# Altium schematic sheet WIFI_BT.SchDoc
size A3
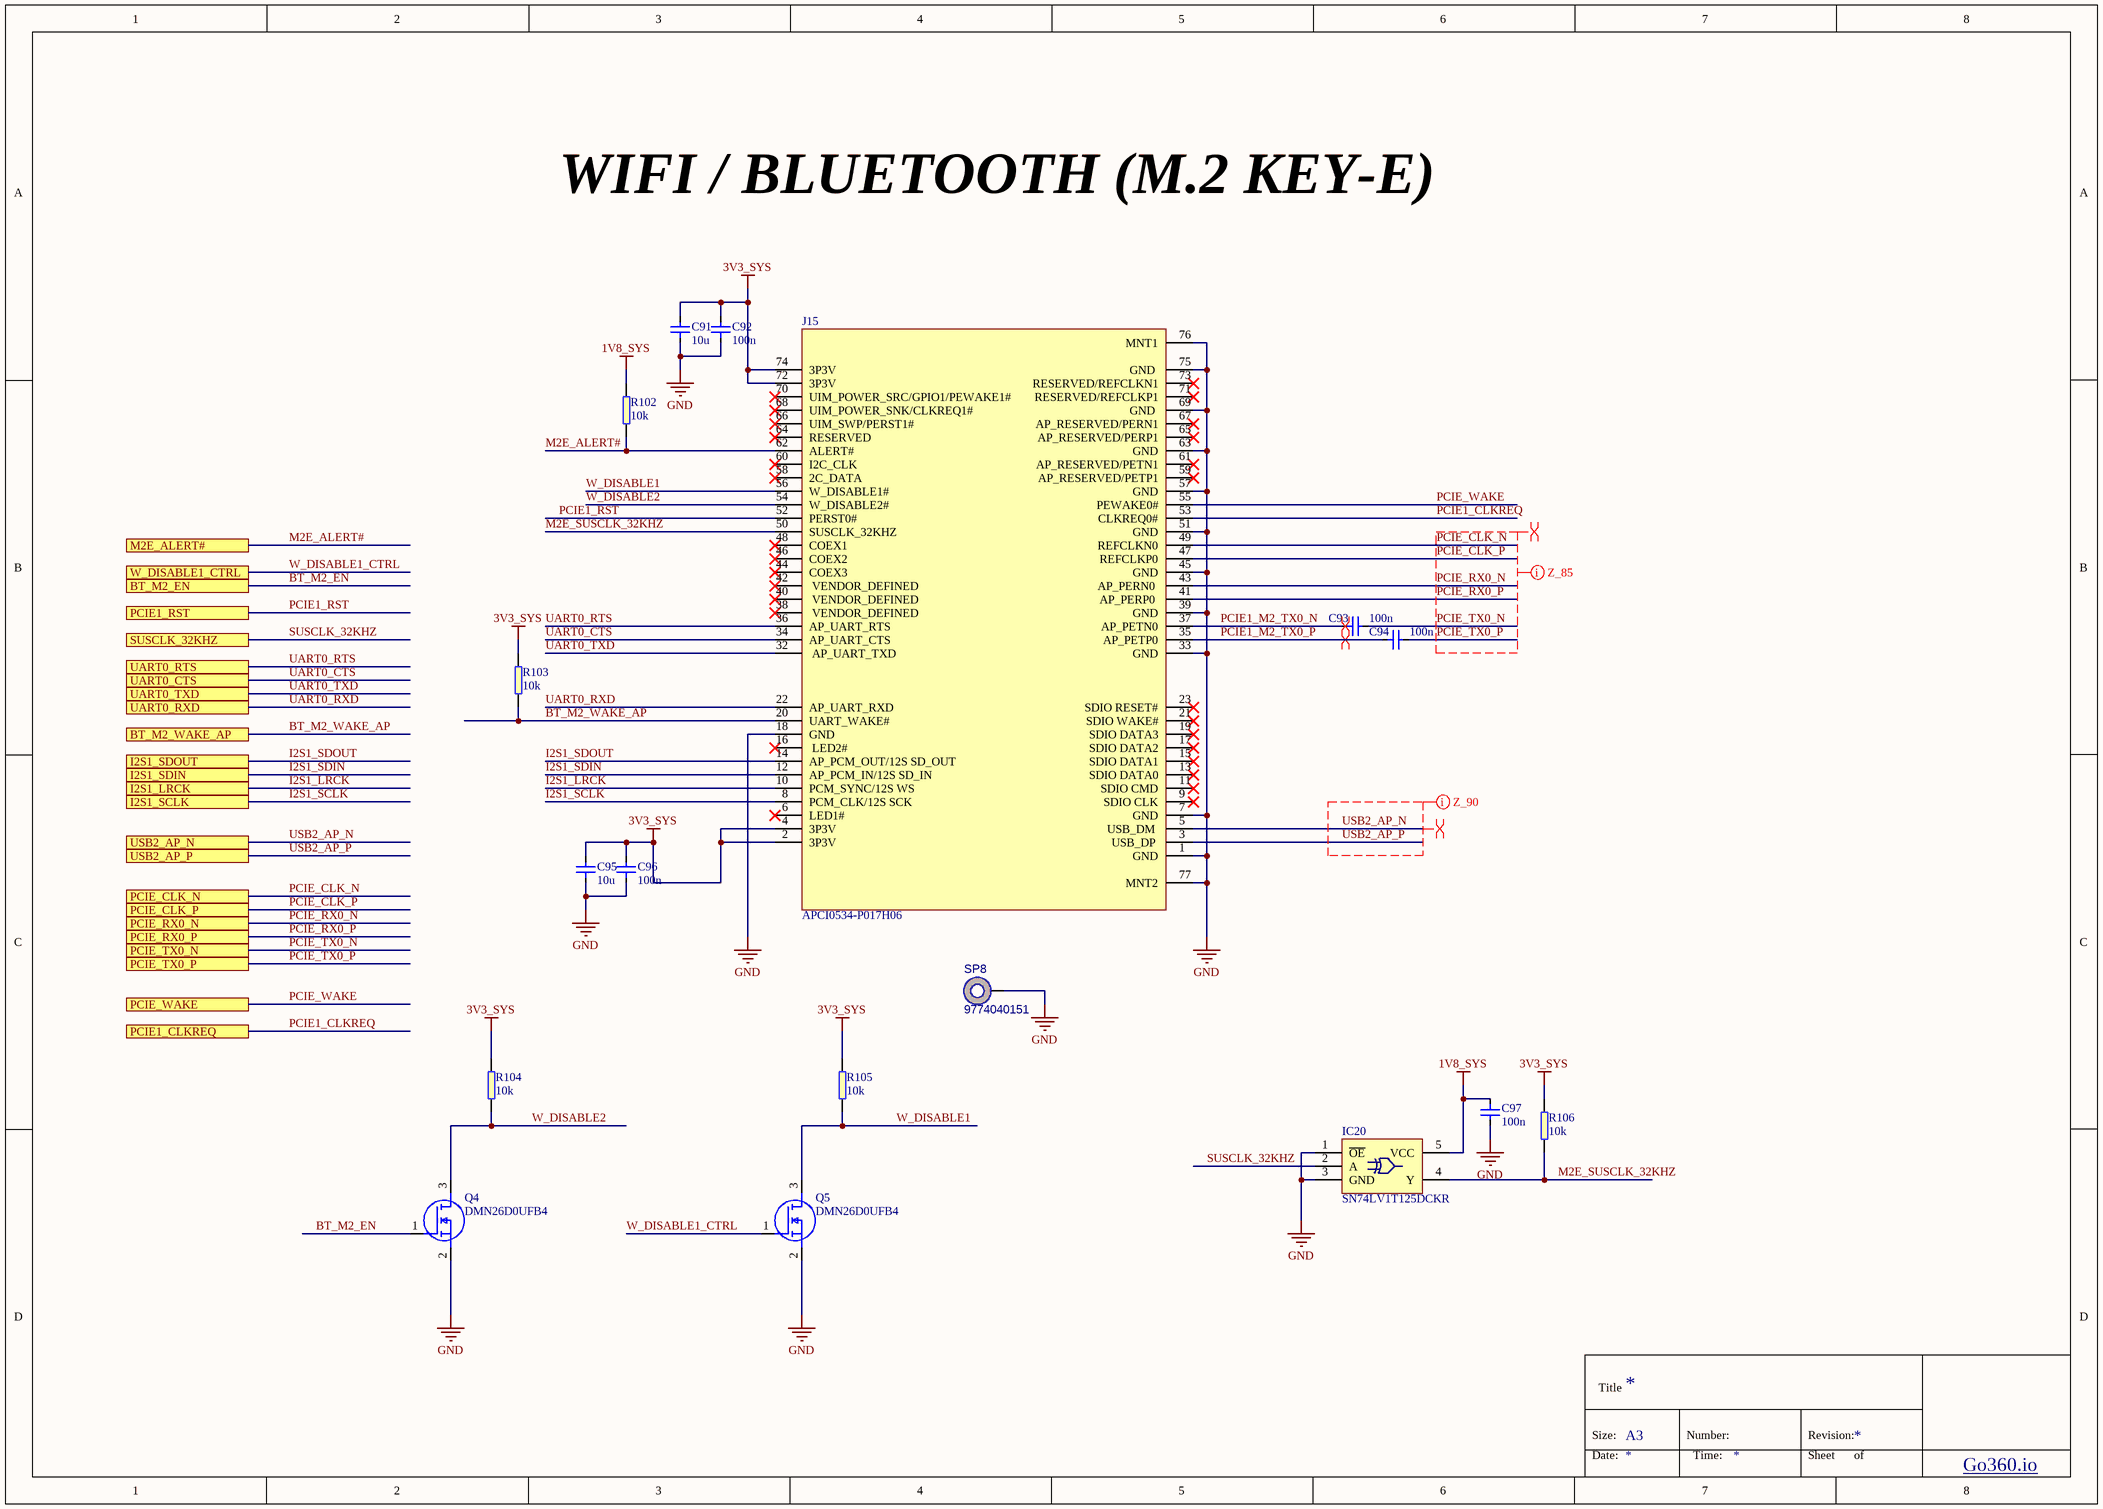
[diagram p0: WIFI_BT.SchDoc]

## Parts
C91  10u  [C0603]
C92  100n  [C0402]
C93  100n  [C0402]
C94  100n  [C0402]
C95  10u  [C0603]
C96  100n  [C0402]
C97  100n  [C0402]
IC20  SN74LV1T125DCKR  [SC70-5]
J15  APCI0534-P017H06  [CON_MINIPEX_067_SMT_RA_M2_KEYE_C]
Q4  DMN26D0UFB4  [DMN26D0UFB47]
Q5  DMN26D0UFB4  [DMN26D0UFB47]
R102  10k  [R0402]
R103  10k  [R0402]
R104  10k  [R0402]
R105  10k  [R0402]
R106  10k  [R0402]
SP8  9774040151  [MEC_STANDOFF_PTH_620C380P]

## Ports
BT_M2_EN, BT_M2_WAKE_AP, I2S1_LRCK, I2S1_SCLK, I2S1_SDIN, I2S1_SDOUT, M2E_ALERT#, PCIE1_CLKREQ, PCIE1_RST, PCIE_CLK_N, PCIE_CLK_P, PCIE_RX0_N, PCIE_RX0_P, PCIE_TX0_N, PCIE_TX0_P, PCIE_WAKE, SUSCLK_32KHZ, UART0_CTS, UART0_RTS, UART0_RXD, UART0_TXD, USB2_AP_N, USB2_AP_P, W_DISABLE1_CTRL

## Nets
1V8_SYS: C97.1 IC20.5(VCC) R102.2
3V3_SYS: C91.2 C92.2 C95.2 C96.2 J15.2(3P3V) J15.4(3P3V) J15.72(3P3V) J15.74(3P3V) R103.2 R104.2 R105.2 R106.2
GND: C91.1 C92.1 C95.1 C96.1 C97.2 IC20.1(~{OE}) IC20.3(GND) J15.1(GND) J15.7(GND) J15.18(GND) J15.33(GND) J15.39(GND) J15.45(GND) J15.51(GND) J15.57(GND) J15.63(GND) J15.69(GND) J15.75(GND) J15.76(MNT1) J15.77(MNT2) Q4.2(S) Q5.2(S) SP8.1
BT_M2_EN: Q4.1(G) ; port BT_M2_EN
BT_M2_WAKE_AP: J15.20(UART_WAKE#) R103.1 ; port BT_M2_WAKE_AP
I2S1_LRCK: J15.10(PCM_SYNC/12S_WS) ; port I2S1_LRCK
I2S1_SCLK: J15.8(PCM_CLK/12S_SCK) ; port I2S1_SCLK
I2S1_SDIN: J15.12(AP_PCM_IN/12S_SD_IN) ; port I2S1_SDIN
I2S1_SDOUT: J15.14(AP_PCM_OUT/12S_SD_OUT) ; port I2S1_SDOUT
M2E_ALERT#: J15.62(ALERT#) R102.1 ; port M2E_ALERT#
M2E_SUSCLK_32KHZ: IC20.4(Y) J15.50(SUSCLK_32KHZ) R106.1
PCIE1_CLKREQ: J15.53(CLKREQ0#) ; port PCIE1_CLKREQ
PCIE1_M2_TX0_N: C93.1 J15.37(AP_PETN0)
PCIE1_M2_TX0_P: C94.1 J15.35(AP_PETP0)
PCIE1_RST: J15.52(PERST0#) ; port PCIE1_RST
PCIE_CLK_N: J15.49(REFCLKN0) ; port PCIE_CLK_N
PCIE_CLK_P: J15.47(REFCLKP0) ; port PCIE_CLK_P
PCIE_RX0_N: J15.43(AP_PERN0) ; port PCIE_RX0_N
PCIE_RX0_P: J15.41(AP_PERP0) ; port PCIE_RX0_P
PCIE_TX0_N: C93.2 ; port PCIE_TX0_N
PCIE_TX0_P: C94.2 ; port PCIE_TX0_P
PCIE_WAKE: J15.55(PEWAKE0#) ; port PCIE_WAKE
SUSCLK_32KHZ: IC20.2(A) ; port SUSCLK_32KHZ
UART0_CTS: J15.34(AP_UART_CTS) ; port UART0_CTS
UART0_RTS: J15.36(AP_UART_RTS) ; port UART0_RTS
UART0_RXD: J15.22(AP_UART_RXD) ; port UART0_RXD
UART0_TXD: J15.32(AP_UART_TXD) ; port UART0_TXD
USB2_AP_N: J15.5(USB_DM) ; port USB2_AP_N
USB2_AP_P: J15.3(USB_DP) ; port USB2_AP_P
W_DISABLE1: J15.56(W_DISABLE1#) Q5.3(D) R105.1
W_DISABLE1_CTRL: Q5.1(G) ; port W_DISABLE1_CTRL
W_DISABLE2: J15.54(W_DISABLE2#) Q4.3(D) R104.1

Not connected (* = marked no-connect by the designer): J15 6(LED1#)* 9(_SDIO_CLK)* 11(SDIO_CMD)* 13(SDIO_DATA0)* 15(SDIO_DATA1)* 16(_LED2#)* 17(SDIO_DATA2)* 19(SDIO_DATA3)* 21(SDIO_WAKE#)* 23(SDIO_RESET#)* 38(_VENDOR_DEFINED)* 40(_VENDOR_DEFINED)* 42(_VENDOR_DEFINED)* 44(COEX3)* 46(COEX2)* 48(COEX1)* 58(2C_DATA)* 59(AP_RESERVED/PETP1)* 60(I2C_CLK)* 61(AP_RESERVED/PETN1)* 64(RESERVED)* 65(AP_RESERVED/PERP1)* 66(UIM_SWP/PERST1#)* 67(AP_RESERVED/PERN1)* 68(UIM_POWER_SNK/CLKREQ1#)* 70(UIM_POWER_SRC/GPIO1/PEWAKE1#)* 71(RESERVED/REFCLKP1)* 73(RESERVED/REFCLKN1)*

## Layout directives
mark named Z_85: PCIE_CLK_N, PCIE_CLK_P, PCIE_RX0_N, PCIE_RX0_P, PCIE_TX0_N, PCIE_TX0_P
differential pair: PCIE1_M2_TX0_N, PCIE1_M2_TX0_P, PCIE_CLK_N, PCIE_CLK_P, PCIE_RX0_N, PCIE_RX0_P, PCIE_TX0_N, PCIE_TX0_P, USB2_AP_N
net class Z_90: USB2_AP_N, USB2_AP_P

## Notes on the sheet
- WIFI / BLUETOOTH (M.2 KEY-E)
- Title
- Size:
- Date:
- A3
- Number:
- Time:
- Revision:
- Sheet
- of
- Go360.io

## Library data of the parts
C91 C95 = C_10u_0603: MLCC SMT Capacitor 10uF 0603; Manufacturer: Walsin; PartSymbol: 0603X106M6R3CT; PartNumber: C_10u_0603; Value: 10u
C92-C94 C96 C97 = C_100n_0402: MLCC SMT Capacitor 100n 0402; Manufacturer: TDK; PartSymbol: C1005X5R0J104K050BA; PartNumber: C_100n_0402; Value: 100n
IC20 = SN74LV1T125: Buffer, 74LV1T125, 1.6 V to 5.5 V, SOT-23-5; Manufacturer: Texas Instruments; PartNumber: SN74LV1T125DCKR; Value: SN74LV1T125DCKR; PartSymbol: SN74LV1T125DCKR
Q4 Q5 = DMN26D0UFB4: MOSFET (N-Channel); Manufacturer_Name: Diodes Inc.; Manufacturer_Part_Number: DMN26D0UFB4-7; Datasheet Link: https://componentsearchengine.com/Datasheets/1/DMN26D0UFB4-7.pdf; Height: 0.4mm; Arrow Part Number: DMN26D0UFB4-7; Arrow Price/Stock: https://www.arrow.com/en/products/dmn26d0ufb4-7/diodes-incorporated; Mouser Part Number: 621-DMN26D0UFB4-7; Mouser Price/Stock: https://www.mouser.co.uk/ProductDetail/Diodes-Incorporated/DMN26D0UFB4-7?qs=GWgl%252BsiMZr%252B4pznsTuF3iQ%3D%3D
R102-R106 = R_10k_0402: RES, 10k, 0402; Manufacturer: MULTICOMP; PartSymbol: MCMR04X1002FTL; PartNumber: R_10k_0402; Value: 10k
SP8 = 9774040151: RND STANDOFF M2.5X0.45 STEEL 4MM; Manufacturer: WURTH ELEKTRONIK; PartNumber: 9774040151; Value: 9774040151; PartSymbol: 9774040151
J15 = APCI0534-P017H06: part number: APCI0534-P017H06